# Altium schematic sheet PP5_MIDI.SchDoc
size 152 x 152 mm
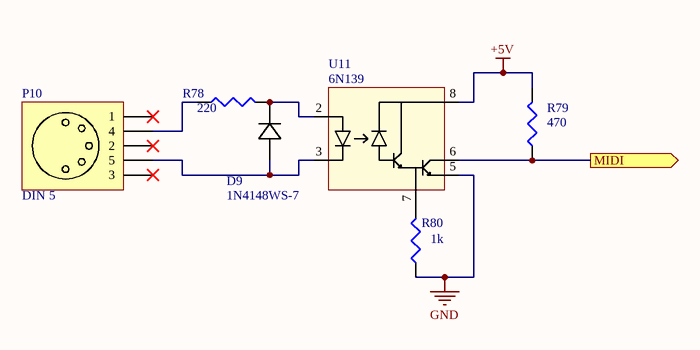
[diagram p0: PP5_MIDI.SchDoc]

## Parts
D9  1N4148WS-7  [SOD323-M]
P10  DIN 5  [PRO SIGNAL_PSG03463]
R78  value 220  [RESC1608X05]  (hidden comment: Cap 220)
R79  value 470  [RESC1608X05]  (hidden comment: Res 470)
R80  value 1k  [RESC1608X05]  (hidden comment: Res 1k)
U11  6N139  [SOIC127P970X356-8N]

## Ports
MIDI (out)

## Nets
+5V: R79.2 U11.8(B1)
GND: R80.1 U11.5(B1)
MIDI: R79.1 U11.6(B1) ; port MIDI
NetD9_1: D9.1 R78.2 U11.2(B2)
NetD9_2: D9.2 P10.5 U11.3(B1)
NetP10_4: P10.4 R78.1
NetR80_2: R80.2 U11.7(B1)

Not connected (* = marked no-connect by the designer): P10 1* 2* 3*

## Library data of the parts
D9 = 1N4148WS-7: Diode signaux faibles; Fabricant: ON SEMICONDUCTOR; Fournisseur: Farnell; RefFournisseur: 2453269; DataSheet: http://www.farnell.com/datasheets/2288055.pdf; RefFabricant: 1N4148WS
P10 = DIN 5pin: Fabricant: PRO SIGNAL; Fournisseur: Farnell; RefFabricant: PSG03463; RefFournisseur: 1791756; DataSheet: http://www.farnell.com/datasheets/1697491.pdf
R78 = Res3: Capacitor; Fabricant: TE CONNECTIVITY; Fournisseur: Farnell; RefFabricant: CRGH0603J220R; RefFournisseur: 2331717; Case: 0603 [1608 Metric]
R79 = Res3: Resistor; Fabricant: TE CONNECTIVITY; Fournisseur: Farnell; RefFabricant: CRGH0603F470R; RefFournisseur: 2331997; Case: 0603 [1608 Metric]
R80 = Res3: Resistor; Fabricant: TE CONNECTIVITY; Fournisseur: Farnell; RefFabricant: CRGH0603F1K0; RefFournisseur: 2332003; Case: 0603 [1608 Metric]; DataSheet: http://www.farnell.com/datasheets/2007183.pdf
U11 = 6N139: Optocoupler; Fabricant: BOADCOM; Fournisseur: Farnell; RefFabricant: 6N139-300E; RefFournisseur: 1085023; DataSheet: http://www.farnell.com/datasheets/1266261.pdf